# Altium schematic sheet 宁波2号线PIS_数字功率放大器_功放板(BHC-A-2030-01)_原理图_01_V1.0 (15).SchDoc
size 594 x 419 mm; SheetNumber: 0; SheetTotal: 0; PageSetup: Record=PageOptions|CenterHorizontal=True|CenterVertical=True|PrintScale=0.48|XCorrection=1.00|YCorrection=1.00|PrintKind=0|BorderSize=5000000|LeftOffset=0|BottomOffset=0|Orientation=2|PaperLength=4200|PaperWidth=2970|Scale=100|PaperSource=15|PrintQuality=1200|MediaType=1|DitherType=10|PaperKind=A4 210 x 297 毫米¦PrintScaleMode=1
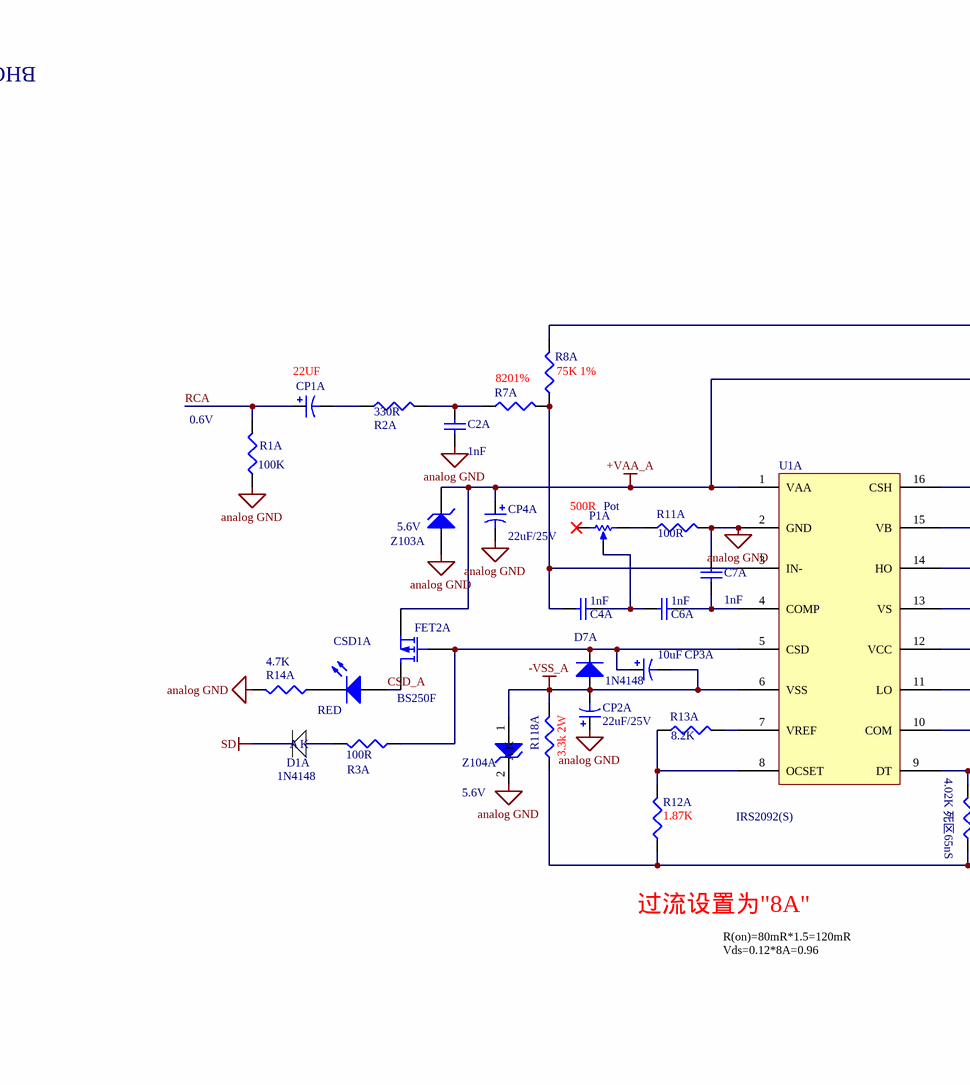
[diagram p0: 宁波2号线PIS_数字功率放大器_功放板(BHC-A-2030-01)_原理图_01_V1.0 (15).SchDoc, top left]
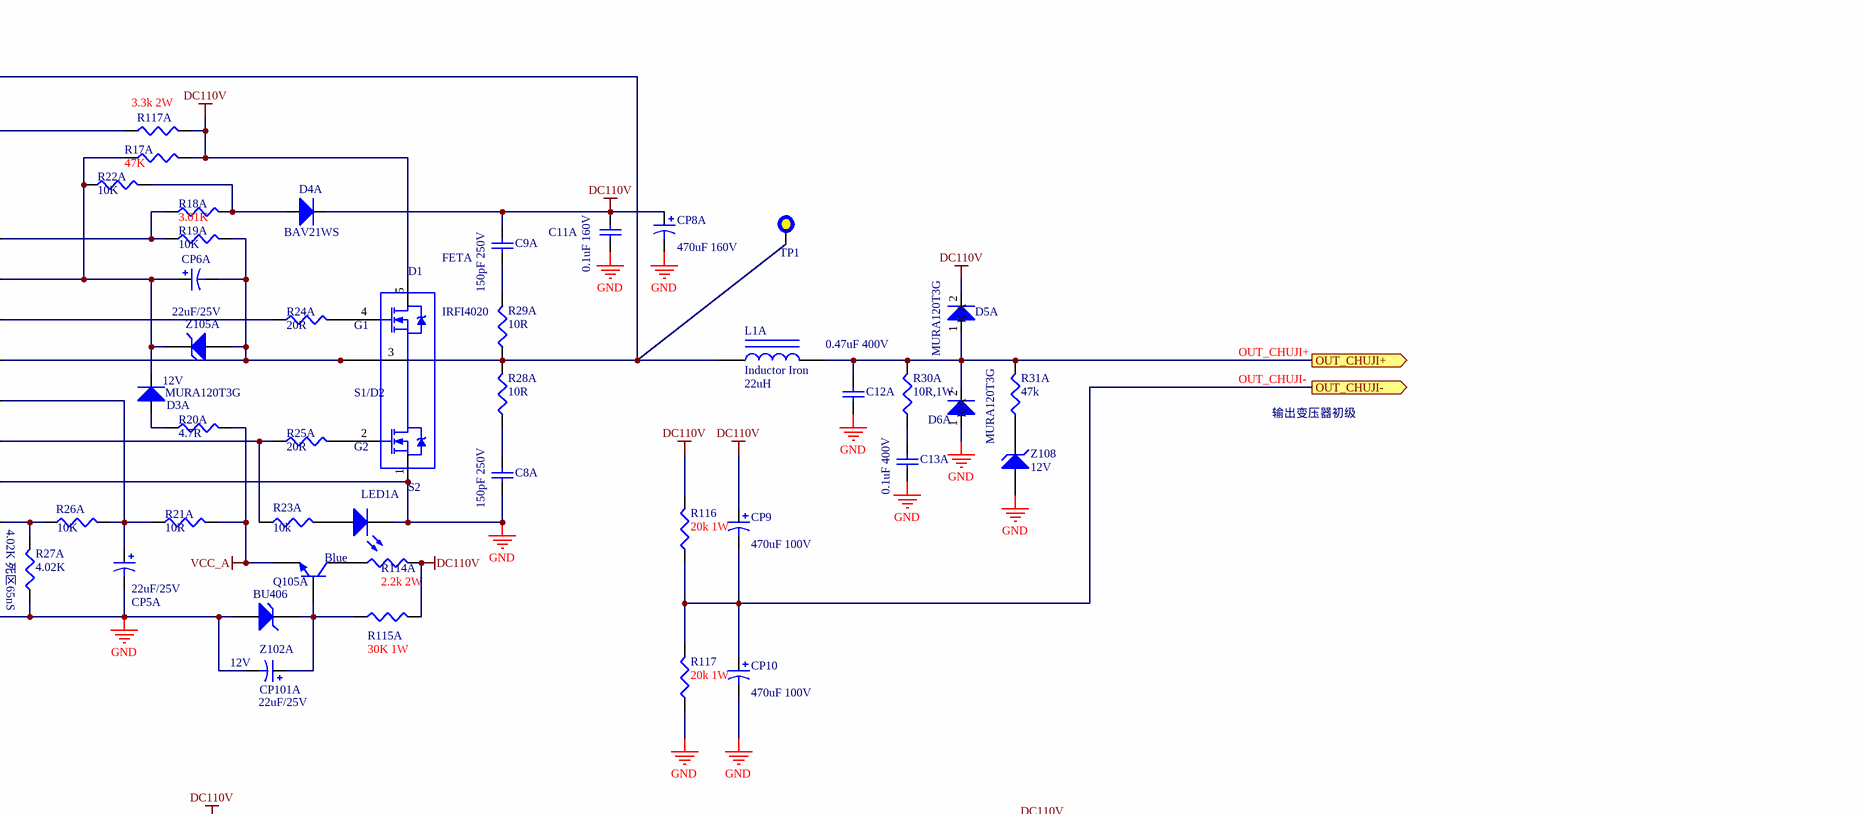
[diagram p1: 宁波2号线PIS_数字功率放大器_功放板(BHC-A-2030-01)_原理图_01_V1.0 (15).SchDoc, top right]
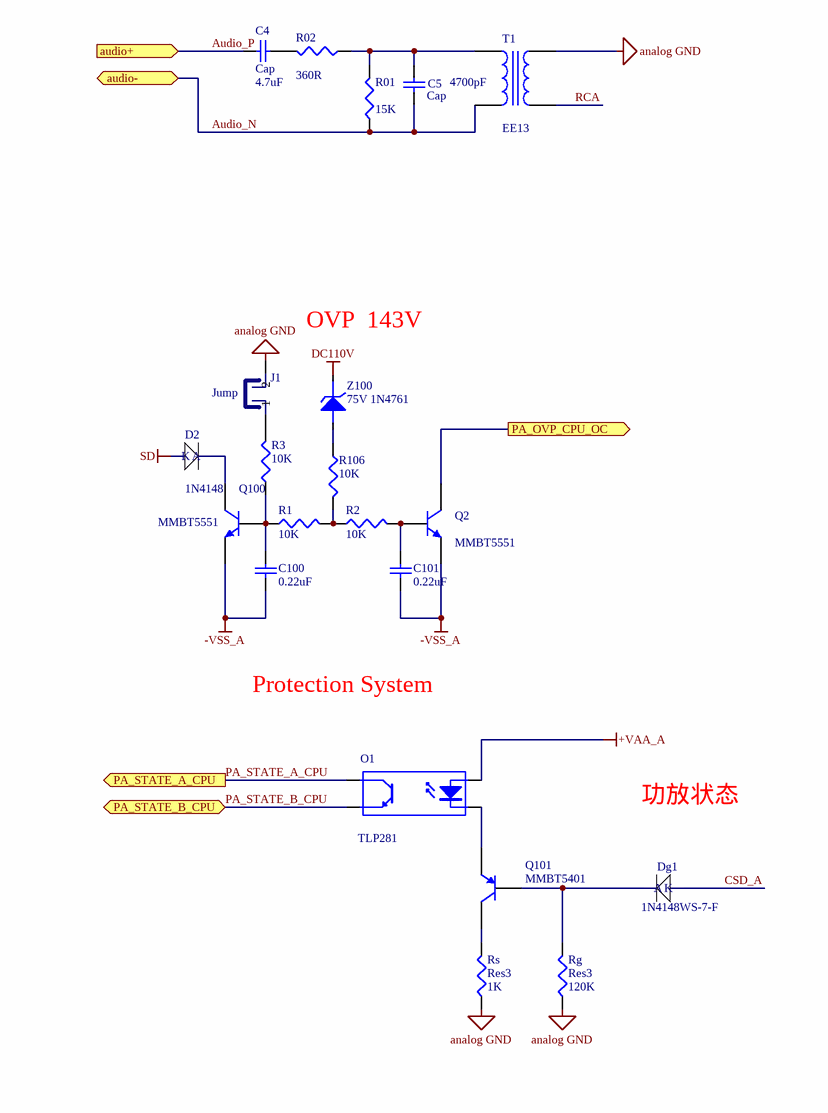
[diagram p2: 宁波2号线PIS_数字功率放大器_功放板(BHC-A-2030-01)_原理图_01_V1.0 (15).SchDoc, bottom left]
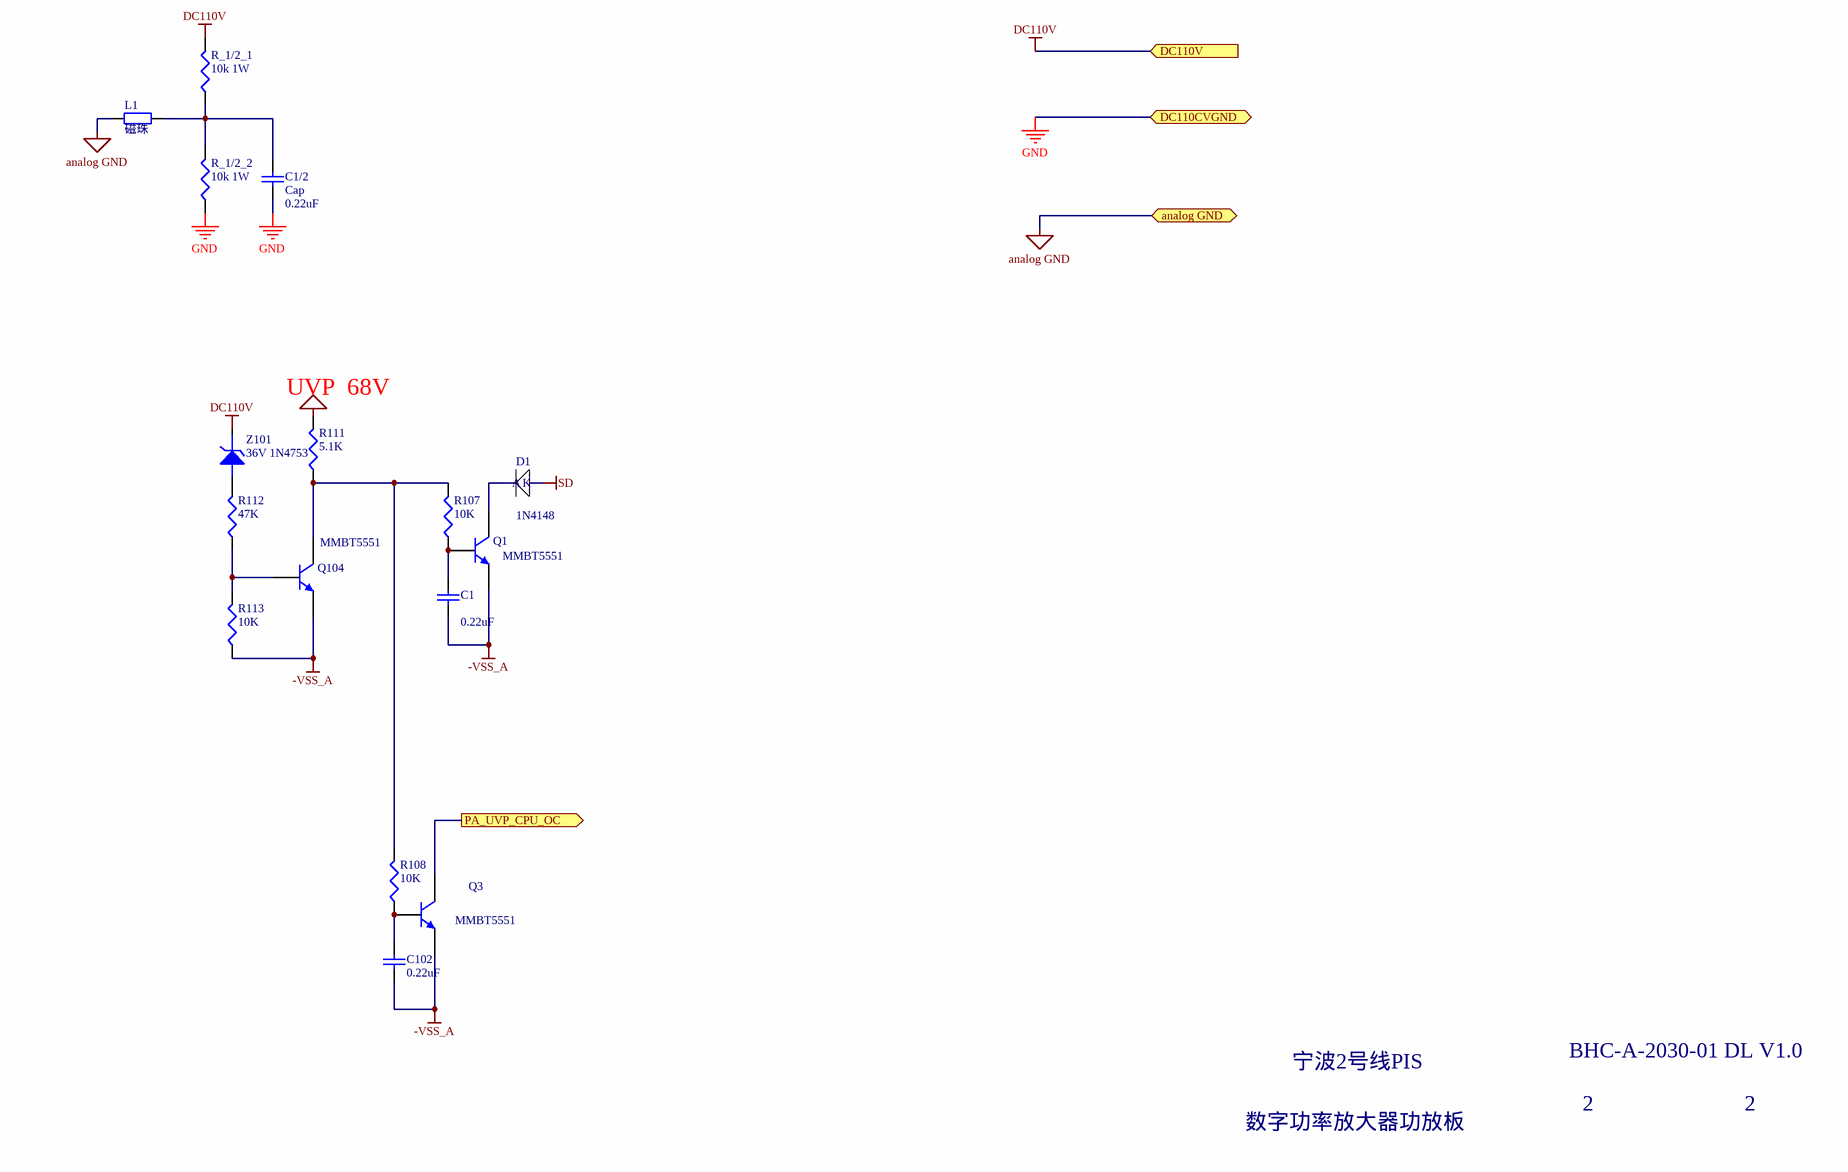
[diagram p3: 宁波2号线PIS_数字功率放大器_功放板(BHC-A-2030-01)_原理图_01_V1.0 (15).SchDoc, bottom right]

## Parts
C1  value 0.22uF  [c0805]
C1/2  Cap  value 0.22uF  [C0805]
C2A  value 1nF  [c0805]
C4  Cap  value 4.7uF  [c0805]
C4A  value 1nF  [c0805]
C5  Cap  value 4700pF  [c0805]
C6A  value 1nF  [c0805]
C7A  value 1nF  [c0805]
C8A  value 150pF 250V  [c0805]
C9A  value 150pF 250V  [c0805]
C11A  value 0.1uF 160V  [MKP-0.1-160V]
C12A  value 0.47uF 400V  [MKP-7.5-10-15-400V]
C13A  value 0.1uF 400V  [MKP-15-100V]
C100  value 0.22uF  [c0805]
C101  value 0.22uF  [c0805]
C102  value 0.22uF  [c0805]
CP1A  value 22UF  [C5*10]
CP2A  value 22uF/25V  [C5*10]
CP3A  value 10uF  [E10]
CP4A  value 22uF/25V  [C5*10]
CP5A  value 22uF/25V  [C5*10]
CP6A  value 22uF/25V  [C5*10]
CP8A  value 470uF 160V  [CD-22*30]
CP9  value 470uF 100V  [CD-22*30]
CP10  value 470uF 100V  [CD-22*30]
CP101A  value 22uF/25V  [C5*10]
CSD1A  RED  [LED-3]
D1  value 1N4148  [SOD-323]
D1A  value 1N4148  [SOD-323]
D2  value 1N4148  [SOD-323]
D3A  value MURA120T3G  [MURA120T3G]  (hidden comment: DIODE)
D4A  value BAV21WS  [SOD-323]  (hidden comment: DIODE)
D5A  value MURA120T3G  [MURA120T3G]  (hidden comment: DIODE)
D6A  value MURA120T3G  [MURA120T3G]  (hidden comment: DIODE)
D7A  value 1N4148  [SOD-323]  (hidden comment: DIODE)
Dg1  value 1N4148WS-7-F  [SOD-323]
FET2A  BS250F  [STO23]
FETA  IRFI4020  [MOS_diy]
J1  Jump  [CH2.54-2]
L1  磁珠  [L-AXIAL0.4]
L1A  Inductor Iron  value 22uH  [7G23A]
LED1A  Blue  [LED-3]
O1  TLP281  [SOP4]
P1A  Pot  value 500R  [3362/3323]
Q1  MMBT5551  [SOT-23B_N]
Q2  MMBT5551  [SOT-23B_N]
Q3  MMBT5551  [SOT-23B_N]
Q100  MMBT5551  [SOT-23B_N]
Q101  MMBT5401  [SOT-23B_N]
Q104  MMBT5551  [SOT-23B_N]
Q105A  value BU406  [TO-220-AB-W]  (hidden comment: TIP31F)
R01  value 15K  [M0805]
R1  value 10K  [M0805]
R1A  value 100K  [M0805]
R2  value 10K  [M0805]
R02  value 360R  [M0805]
R2A  value 330R  [M0805]
R3  value 10K  [M0805]
R3A  value 100R  [M0805]
R7A  value 8201%  [M0805]
R8A  value 75K 1%  [M0805]
R11A  value 100R  [M0805]
R12A  value 1.87K  [M0805]
R13A  value 8.2K  [M0805]
R14A  value 4.7K  [M0805]
R17A  value 47K  [M0805]
R18A  value 3.01K  [M0805]
R19A  value 10K  [M0805]
R20A  value 4.7R  [M1206]
R21A  value 10R  [M1206]
R22A  value 10K  [M0805]
R23A  value 10k  [M0805]
R24A  value 20R  [M0805]  (hidden comment: res)
R25A  value 20R  [M0805]
R26A  value 10K  [M0805]  (hidden comment: Res3)
R27A  value 4.02K  [M0805]
R28A  value 10R  [M0805]
R29A  value 10R  [M0805]
R30A  value 10R,1W  [M2512R]
R31A  value 47k  [M0805]
R106  value 10K  [M0805]
R107  value 10K  [M0805]
R108  value 10K  [M0805]
R111  value 5.1K  [M0805]
R112  value 47K  [M0805]
R113  value 10K  [M0805]
R114A  value 2.2k 2W  [R-2W]
R115A  value 30K 1W  [R-1W]
R116  value 20k 1W  [1T-2512]
R117  value 20k 1W  [1T-2512]
R117A  value 3.3k 2W  [R-2W]
R118A  value 3.3k 2W  [R-2W]
R_1/2_1  value 10k 1W  [R-1W]
R_1/2_2  value 10k 1W  [R-1W]
Rg  Res3  value 120K  [M0805]
Rs  Res3  value 1K  [M0805]
T1  EE13  [EE13-C]
TP1  TP  [TP]  (value not drawn)
U1A  value IRS2092(S)  [SOIC16_N]
Z100  75V 1N4761  [AXIAL0.4AK]
Z101  36V 1N4753  [AXIAL0.4AK]
Z102A  12V  [AXIAL0.4AK]
Z103A  5.6V  [AXIAL0.4AK-V]
Z104A  5.6V  [AXIAL0.4AK-V]
Z105A  12V  [SOD-323]
Z108  12V  [SOD-323]

## Ports
analog GND (bidir), audio+ (in), audio- (bidir), DC110CVGND (bidir), DC110V (in), OUT_CHUJI+ (out), OUT_CHUJI- (out), PA_OVP_CPU_OC (out), PA_STATE_A_CPU (out), PA_STATE_B_CPU (bidir), PA_UVP_CPU_OC (out)

## Nets
+VAA_A: CP4A.1 FET2A.3(S) O1.1(A) R117A.1 U1A.1(VAA) Z103A.2(K)
-VSS_A: C1.1 C100.1 C101.1 C102.1 CP2A.2 CP3A.2 D7A.1(A) Q1.2(E) Q2.2(E) Q3.2(E) Q100.2(E) Q104.2(E) R113.2 R118A.2 U1A.6(VSS) Z104A.1(A)
analog GND: C2A.1 C7A.1 CP2A.1 CP4A.2 J1.2 L1.1 R1A.1 R11A.2 R14A.2 R111.1 Rg.1 Rs.1 T1.5 U1A.2(GND) Z103A.1(A) Z104A.2(K) ; port analog GND
DC110V: C9A.2 C11A.2 CP8A.1 CP9.1 D4A.2(K) D5A.2(K) FETA.5(D1) R17A.2 R114A.2 R115A.2 R116.2 R117A.2 R_1/2_1.2 Z100.2(K) Z101.2(K) ; port DC110V
GND: C1/2.1 C8A.1 C11A.1 C12A.1 C13A.1 CP5A.2 CP8A.2 CP10.2 CP101A.2 D6A.1(A) FETA.1(S2) LED1A.2(K) R12A.1 R27A.1 R117.1 R118A.1 R_1/2_2.1 U1A.10(COM) Z102A.1(A) Z108.1(A) ; port DC110CVGND
SD: D1.1(A) D1A.2(K) D2.1(A)
VCC_A: Q105A.3(E) R20A.2 R21A.2
Audio_N: C5.1 R01.1 T1.2 ; port audio-
Audio_P: C4.1 ; port audio+
CSD_A: CSD1A.1(A) Dg1.1(A) FET2A.1(D)
OUT_CHUJI+: C12A.2 D5A.1(A) D6A.2(K) L1A.2 R30A.2 R31A.2 ; port OUT_CHUJI+
OUT_CHUJI-: CP9.2 CP10.1 R116.1 R117.2 ; port OUT_CHUJI-
PA_OVP_CPU_OC: Q2.3(C) ; port PA_OVP_CPU_OC
PA_STATE_A_CPU: O1.4(C) ; port PA_STATE_A_CPU
PA_STATE_B_CPU: O1.3(E) ; port PA_STATE_B_CPU
PA_UVP_CPU_OC: Q3.3(C) ; port PA_UVP_CPU_OC
RCA: CP1A.1 R1A.2 T1.3
NetC1/2_2: C1/2.2 L1.2 R_1/2_1.1 R_1/2_2.2
NetC1_2: C1.2 Q1.1(B) R107.2
NetC2A_2: C2A.2 R2A.2 R7A.1
NetC4_2: C4.2 R02.2
NetC4A_1: C4A.1 R7A.2 R8A.1 U1A.3(IN-)
NetC4A_2: C4A.2 C6A.1 P1A.2
NetC5_2: C5.2 R01.2 R02.1 T1.1
NetC6A_2: C6A.2 C7A.2 U1A.4(COMP)
NetC8A_2: C8A.2 R28A.1
NetC9A_1: C9A.1 R29A.2
NetC13A_2: C13A.2 R30A.1
NetC100_2: C100.2 Q100.1(B) R1.1 R3.1
NetC101_2: C101.2 Q2.1(B) R2.2
NetC102_2: C102.2 Q3.1(B) R108.2
NetCP1A_2: CP1A.2 R2A.1
NetCP3A_1: CP3A.1 D7A.2(K) FET2A.2(G) R3A.1 U1A.5(CSD)
NetCP5A_1: CP5A.1 R21A.1 R26A.2 U1A.12(VCC)
NetCP6A_1: CP6A.1 D3A.2(K) R17A.1 R22A.1 U1A.15(VB) Z105A.2(K)
NetCP6A_2: CP6A.2 FETA.3(S1/D2) L1A.1 R8A.2 R19A.2 R28A.2 R29A.1 TP1.1 U1A.13(VS) Z105A.1(A)
NetCP101A_1: CP101A.1 Q105A.1(B) R115A.1 Z102A.2(K)
NetCSD1A_2: CSD1A.2(K) R14A.1
NetD1_2: D1.2(K) Q1.3(C)
NetD1A_1: D1A.1(A) R3A.2
NetD2_2: D2.2(K) Q100.3(C)
NetD3A_1: D3A.1(A) R20A.1
NetD4A_1: D4A.1(A) R18A.2 R22A.2
NetDg1_2: Dg1.2(K) Q101.1(B) Rg.2
NetFETA_2: FETA.2(G2) R25A.2
NetFETA_4: FETA.4(G1) R24A.2
NetJ1_1: J1.1 R3.2
NetLED1A_1: LED1A.1(A) R23A.2
NetO1_2: O1.2(K) Q101.2(E)
NetP1A_3: P1A.3 R11A.1
NetQ101_3: Q101.3(C) Rs.2
NetQ104_1: Q104.1(B) R112.2 R113.1
NetQ104_3: Q104.3(C) R107.1 R108.1 R111.2
NetQ105A_2: Q105A.2(C) R114A.1
NetR1_2: R1.2 R2.1 R106.2
NetR12A_2: R12A.2 R13A.1 U1A.8(OCSET)
NetR13A_2: R13A.2 U1A.7(VREF)
NetR18A_1: R18A.1 R19A.1 U1A.16(CSH)
NetR23A_1: R23A.1 R25A.1 U1A.11(LO)
NetR24A_1: R24A.1 U1A.14(HO)
NetR26A_1: R26A.1 R27A.2 U1A.9(DT)
NetR31A_1: R31A.1 Z108.2(K)
NetR106_1: R106.1 Z100.1(A)
NetR112_1: R112.1 Z101.1(A)

Not connected (* = marked no-connect by the designer): P1A 1*; T1 4

## Notes on the sheet
- BHC-A-2030-01 DL V1.0
- (near R1A) 0.6V
- OUT_CHUJI+
- OUT_CHUJI-
- 输出变压器初级
- (near R27A) 4.02K 死区65nS
- 过流设置为"8A"
- LPF 设置
  L1A=7313NC（220uH，150uH，120uH，100uH）
  C12A=（0.047uF，0.0689uF，0.0862uF，1034uF）
  Vgnd 设置
  HK RM 470uF 16*25
  HK LQ  470uF 18*25
- R(on)=80mR*1.5=120mR
  Vds=0.12*8A=0.96
- OVP  143V
- UVP  68V
- Protection System
- 功放状态
- 宁波2号线PIS
- 数字功率放大器功放板
- 2
- 媒体编号
- 旧底图总号
- 更改
- 标记
- 数量
- 更改单号
- 签 名
- 日期
- 底图总号
- 拟  制
- 审  核
- 标准化
- 第      张
- 天津市北海通信技术有限公司
- 共      张
- 格式
- (3)
- 制图
- 批  准
- ：
- 描图
- 图幅

## Library data of the parts
C1 C1/2 C2A C4 C4A C5 C6A C7A C8A C9A C11A C12A C13A C100-C102 = Cap: Capacitor; Published: 8-Jun-2000; LatestRevisionDate: 17-Jul-2002; LatestRevisionNote: Re-released for DXP Platform.; PackageReference: RAD-0.3; Publisher: Altium Limited; PackageDescription: Radial Cap, Thru-Hole; 2 Leads; 0.3 in Pin Spacing
CP1A CP2A CP3A CP4A CP5A CP6A CP8A CP9 CP10 CP101A = Cap Pol1: Polarized Capacitor (Radial); Published: 8-Jun-2000; LatestRevisionDate: 17-Jul-2002; LatestRevisionNote: Re-released for DXP Platform.; Publisher: Altium Limited; PackageDescription: Polarized Capacitor (Radial); 2 Leads
  CP1A CP2A CP4A CP5A CP6A CP101A: PackageReference: C5*10
  CP3A CP8A CP9 CP10: PackageReference: RB7.6-15
CSD1A = LED2: Typical RED, GREEN, YELLOW, AMBER GaAs LED; Published: 8-Jun-2000; LatestRevisionDate: 17-Jul-2002; LatestRevisionNote: Re-released for DXP Platform.; PackageVersion: Feb-2002; PackageReference: 3.2X1.6X1.1; Publisher: Altium Limited; PackageDescription: SM LED; 2 Flat Leads; Value: RED
D1 D1A D2 Dg1 = D
D3A D4A D5A D6A D7A = DIODE: Default Diode; Text Field6: Published 8-Jun-2000
FET2A = MOSFET-P: P-Channel MOSFET; Published: 8-Jun-2000; LatestRevisionDate: 17-Jul-2002; LatestRevisionNote: Re-released for DXP Platform.; PackageVersion: 1995/1996; PackageReference: E3; Publisher: Altium Limited; PackageDescription: TO, Flat Index; 3 In-Line, Axial Leads; Body Dia. 4.6mm; Lead Dia. 0.5 mm (max); Value: BS250F
FETA = IRF4019H-117P
L1 = Res2: inductor; Published: 8-Jun-2000; LatestRevisionDate: 17-Jul-2002; LatestRevisionNote: Re-released for DXP Platform.; PackageReference: AXIAL-0.4; Publisher: Altium Limited; PackageDescription: Axial Device, Thru-Hole; 2 Leads; 0.4 in Pin Spacing; Value: 磁珠
L1A = Inductor Iron: Magnetic-Core Inductor; Published: 24-Mar-1999; LatestRevisionDate: 17-Jul-2002; LatestRevisionNote: Re-released for DXP Platform.; PackageReference: AXIAL-0.9; Publisher: Altium Limited; PackageDescription: Axial Device, Thru-Hole; 2 Leads; 0.9 in Pin Spacing
LED1A = LED1: Typical RED GaAs LED; Published: 8-Jun-2000; LatestRevisionDate: 08-Jul-2005; LatestRevisionNote: Mech Layer 1 removed.; PackageReference: LED-1; Publisher: Altium Limited; PackageDescription: LED; 2 Leads; Value: Blue
O1 = Optoisolator1: 4-Pin Phototransistor Optocoupler; Published: 24-Mar-1999; LatestRevisionDate: 04-Mar-2005; LatestRevisionNote: Sch pins 3 & 4 Swapped.; DatasheetVersion: Nov-2003; PackageReference: DIP-4; Publisher: Altium Limited; Value: TLP281
P1A = RPot: Potentiometer; Sim Note: Enter the Resistance value and the set point into parameter fields.; Set Position: 0.5; Published: 8-Jun-2000; LatestRevisionDate: 17-Jul-2002; LatestRevisionNote: Re-released for DXP Platform.; PackageReference: VR5; Publisher: Altium Limited; PackageDescription: Variable Resistor, Thru-Hole; 3 Leads
Q1-Q3 Q100 Q104 = NPN: NPN Bipolar Transistor; Published: 8-Jun-2000; LatestRevisionDate: 17-Jul-2002; LatestRevisionNote: Re-released for DXP Platform.; PackageReference: TO-226-AA; Publisher: Altium Limited; PackageDescription: TO, Flat Index; 3 In-Line, Axial Leads; Body Dia. 4.8mm; Leads 0.55 x 0.51 mm (max); Code_JEDEC: TO-226-AA; Value: MMBT5551
Q101 = PNP: PNP Bipolar Transistor; Published: 8-Jun-2000; LatestRevisionDate: 29-May-2009; LatestRevisionNote: IPC-7351 Footprint Added.; PackageVersion: Aug-1999; PackageReference: SOT-23B; Publisher: Altium Limited; PackageDescription: 3-Pin SOT-23 Package 0.95 mm Pitch, 2.4 mm Lead Span
Q105A = QNPN: NPN Bipolar Transistor; Published: 8-Jun-2000; LatestRevisionDate: 29-May-2009; LatestRevisionNote: IPC-7351 Footprint Added.; PackageVersion: Aug-1999; PackageReference: SOT-23B; Publisher: Altium Limited; PackageDescription: 3-Pin SOT-23 Package 0.95 mm Pitch, 2.4 mm Lead Span
R01 R1 R1A R2 R02 R2A R3 R3A R7A R8A R11A R12A R13A R14A R17A R18A R19A R20A R21A R22A R23A R24A R25A R26A R27A R28A R29A R30A R31A R106-R108 R111-R113 R114A R115A R116 R117 R117A R118A R_1/2_1 R_1/2_2 Rg Rs = Res3: Resistor; Published: 8-Jun-2000; LatestRevisionDate: 29-May-2009; LatestRevisionNote: IPC-7351 Footprint Added.; PackageReference: J1-0603; Publisher: Altium Limited; PackageDescription: Chip Resistor
U1A = IRS2092(S): Supplier 1: Farnell; Supplier Part Number 1: 1506807
Z100 Z101 = ZENER
Z102A Z103A Z104A Z105A Z108 = D Zener: Zener Diode; Published: 8-Jun-2000; LatestRevisionDate: 17-Jul-2002; LatestRevisionNote: Re-released for DXP Platform.; PackageReference: DIODE-0.7; Publisher: Altium Limited; PackageDescription: Diode, Thru-Hole; 2 Leads; 0.7 in Pin Spacing
  Z102A Z105A Z108: Value: 12V
  Z103A Z104A: Value: 5.6V
T1 = EE13: Value: EE13